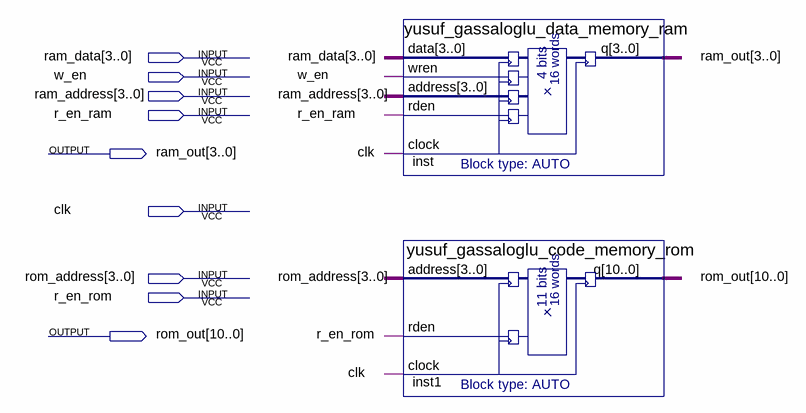
[diagram p0: schematic sheet]
// Quartus schematic yusuf_gassaloglu_2020510034_HW2.bdf as structural Verilog: 2 symbols, 9 pins
module yusuf_gassaloglu_2020510034_HW2 (
  input  [3:0] ram_data,
  input  w_en,
  input  [3:0] ram_address,
  input  r_en_ram,
  input  clk,
  input  [3:0] rom_address,
  input  r_en_rom,
  output [3:0] ram_out,
  output [10:0] rom_out
);

  yusuf_gassaloglu_data_memory_ram inst (
    .data(ram_data), .wren(w_en), .address(ram_address), .rden(r_en_ram), .clock(clk), .q(ram_out));
  yusuf_gassaloglu_code_memory_rom inst1 (.address(rom_address), .rden(r_en_rom), .clock(clk), .q(rom_out));
endmodule
